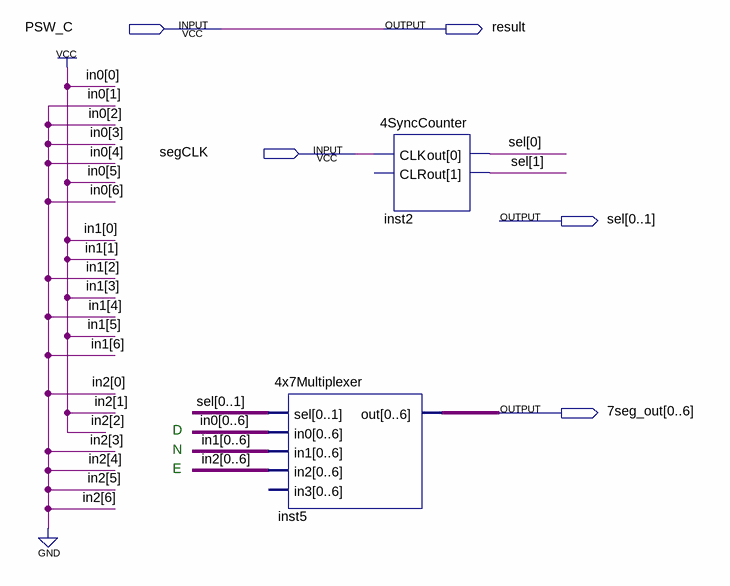
[diagram p0: schematic sheet]
// Quartus schematic DisplayEND.bdf as structural Verilog: 2 symbols, 5 pins
module DisplayEND (
  input  PSW_C,
  input  segCLK,
  output result,
  output [0:1] sel,
  output [0:6] \7seg_out 
);

  \4x7Multiplexer  inst5 (
    .sel(sel), .in0(7'b1000010), .in1(7'b1101010), .in2(7'b0110000), .out(\7seg_out ));  // open: in3
  \4SyncCounter  inst2 (.CLK(segCLK), .out({sel[1], sel[0]}));  // open: CLR

  assign result = PSW_C;

  // Notes on the sheet:
  //   D
  //   N
  //   E
endmodule
